# Altium schematic sheet FPGA Symbol1.SchDoc
size A4; Organization: Altium Limited; Address1: L3, 12a Rodborough Rd; Address2: Frenchs Forest; Address3: NSW; Address4: Australia 2086; DocumentNumber: 6; SheetNumber: 6; SheetTotal: 7
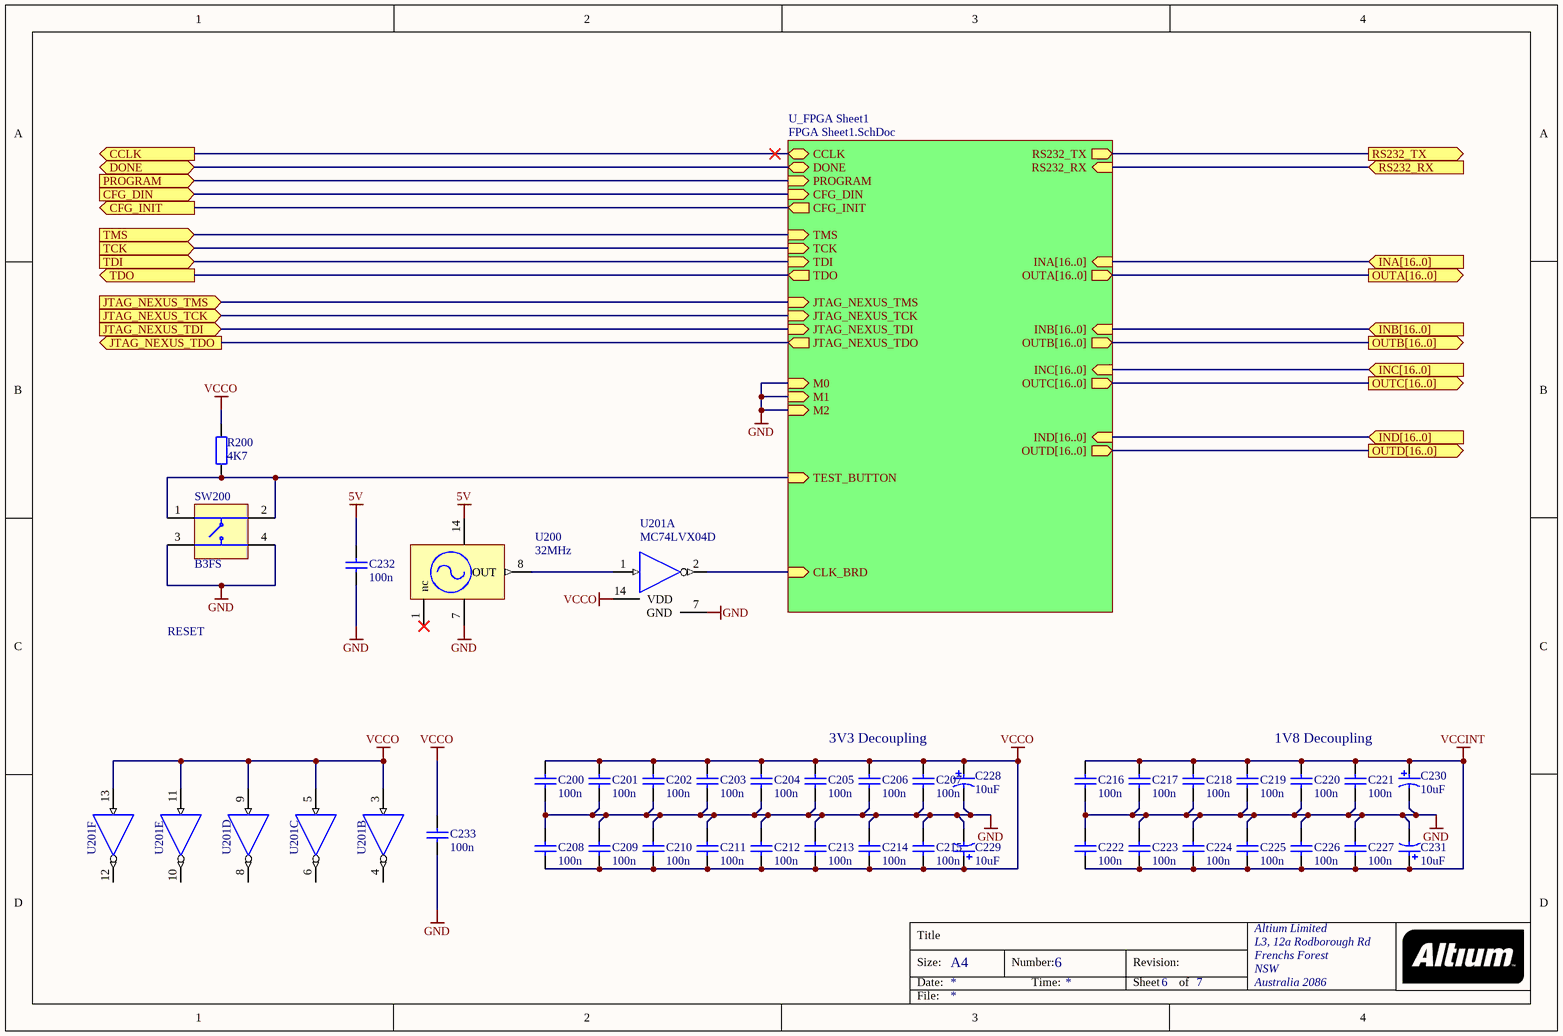
[diagram p0: FPGA Symbol1.SchDoc]

## Parts
C200  100n  [CC2012-0805]
C201  100n  [CC2012-0805]
C202  100n  [CC2012-0805]
C203  100n  [CC2012-0805]
C204  100n  [CC2012-0805]
C205  100n  [CC2012-0805]
C206  100n  [CC2012-0805]
C207  100n  [CC2012-0805]
C208  100n  [CC2012-0805]
C209  100n  [CC2012-0805]
C210  100n  [CC2012-0805]
C211  100n  [CC2012-0805]
C212  100n  [CC2012-0805]
C213  100n  [CC2012-0805]
C214  100n  [CC2012-0805]
C215  100n  [CC2012-0805]
C216  100n  [CC2012-0805]
C217  100n  [CC2012-0805]
C218  100n  [CC2012-0805]
C219  100n  [CC2012-0805]
C220  100n  [CC2012-0805]
C221  100n  [CC2012-0805]
C222  100n  [CC2012-0805]
C223  100n  [CC2012-0805]
C224  100n  [CC2012-0805]
C225  100n  [CC2012-0805]
C226  100n  [CC2012-0805]
C227  100n  [CC2012-0805]
C228  10uF  [MCCT-B]
C229  10uF  [MCCT-B]
C230  10uF  [MCCT-B]
C231  10uF  [MCCT-B]
C232  100n  [CC2012-0805]
C233  100n  [CC2012-0805]
R200  4K7  [CC2012-0805]
SW200  B3FS  [B3FS_SWITCH]
U200  32MHz  [XO600CP]
U201  MC74LVX04D  [751A-03]  (parts A,B,C,D,E,F of 6)

## Sub-sheets
U_FPGA Sheet1 = FPGA Sheet1.SchDoc: CFG_DIN (in), CFG_INIT (out), CLK_BRD (in), INA[16..0] (in), INC[16..0] (in), JTAG_NEXUS_TCK (in), JTAG_NEXUS_TDI (in), JTAG_NEXUS_TDO (out), JTAG_NEXUS_TMS (in), OUTA[16..0] (out), OUTB[16..0] (out), OUTC[16..0] (out), OUTD[16..0] (out), RS232_RX (in), RS232_TX (out), TEST_BUTTON (in), CCLK (bidir), DONE (bidir), M0 (in), M1 (in), M2 (in), PROGRAM (in), TCK (in), TDI (in), TDO (out), TMS (in), INB[16..0] (in), IND[16..0] (in)

## Ports
CCLK (out), CFG_DIN (in), CFG_INIT (out), DONE (bidir), INA[16..0] (in), INB[16..0] (in), INC[16..0] (in), IND[16..0] (in), JTAG_NEXUS_TCK (in), JTAG_NEXUS_TDI (in), JTAG_NEXUS_TDO (out), JTAG_NEXUS_TMS (in), OUTA[16..0] (out), OUTB[16..0] (out), OUTC[16..0] (out), OUTD[16..0] (out), PROGRAM (in), RS232_RX (in), RS232_TX (out), TCK (in), TDI (in), TDO (out), TMS (in)

## Nets
5V: C232.1 U200.14(VCC)
GND: C200.2 C201.2 C202.2 C203.2 C204.2 C205.2 C206.2 C207.2 C208.1 C209.1 C210.1 C211.1 C212.1 C213.1 C214.1 C215.1 C216.2 C217.2 C218.2 C219.2 C220.2 C221.2 C222.1 C223.1 C224.1 C225.1 C226.1 C227.1 C228.2 C229.2 C230.2 C231.2 C232.2 C233.2 SW200.3 SW200.4 U200.7(GND) U201.7(GND) ; sheet U_FPGA Sheet1/M0, sheet U_FPGA Sheet1/M1, sheet U_FPGA Sheet1/M2
VCCINT: C216.1 C217.1 C218.1 C219.1 C220.1 C221.1 C222.2 C223.2 C224.2 C225.2 C226.2 C227.2 C230.1 C231.1
VCCO: C200.1 C201.1 C202.1 C203.1 C204.1 C205.1 C206.1 C207.1 C208.2 C209.2 C210.2 C211.2 C212.2 C213.2 C214.2 C215.2 C228.1 C229.1 C233.1 R200.2 U201.3(IN) U201.5(IN) U201.9(IN) U201.11(IN) U201.13(IN) U201.14(VDD)
CCLK: port CCLK, sheet U_FPGA Sheet1/CCLK
CFG_DIN: port CFG_DIN, sheet U_FPGA Sheet1/CFG_DIN
CFG_INIT: port CFG_INIT, sheet U_FPGA Sheet1/CFG_INIT
DONE: port DONE, sheet U_FPGA Sheet1/DONE
JTAG_NEXUS_TCK: port JTAG_NEXUS_TCK, sheet U_FPGA Sheet1/JTAG_NEXUS_TCK
JTAG_NEXUS_TDI: port JTAG_NEXUS_TDI, sheet U_FPGA Sheet1/JTAG_NEXUS_TDI
JTAG_NEXUS_TDO: port JTAG_NEXUS_TDO, sheet U_FPGA Sheet1/JTAG_NEXUS_TDO
JTAG_NEXUS_TMS: port JTAG_NEXUS_TMS, sheet U_FPGA Sheet1/JTAG_NEXUS_TMS
PROGRAM: port PROGRAM, sheet U_FPGA Sheet1/PROGRAM
RS232_RX: port RS232_RX, sheet U_FPGA Sheet1/RS232_RX
RS232_TX: port RS232_TX, sheet U_FPGA Sheet1/RS232_TX
TCK: port TCK, sheet U_FPGA Sheet1/TCK
TDI: port TDI, sheet U_FPGA Sheet1/TDI
TDO: port TDO, sheet U_FPGA Sheet1/TDO
TMS: port TMS, sheet U_FPGA Sheet1/TMS
NetR200_1: R200.1 SW200.1 SW200.2 ; sheet U_FPGA Sheet1/TEST_BUTTON
NetU200_8: U200.8(OUT) U201.1(IN)
NetU201_2: U201.2(~{OUT}) ; sheet U_FPGA Sheet1/CLK_BRD

Not connected (* = marked no-connect by the designer): U200 1(nc)*; U201 4(~{OUT}) 6(~{OUT}) 8(~{OUT}) 10(~{OUT}) 12(~{OUT})

## Buses and harness runs
bus port INA[16..0] = sheet U_FPGA Sheet1/INA[16..0]
bus port INB[16..0] = sheet U_FPGA Sheet1/INB[16..0]
bus port INC[16..0] = sheet U_FPGA Sheet1/INC[16..0]
bus port IND[16..0] = sheet U_FPGA Sheet1/IND[16..0]
bus port OUTA[16..0] = sheet U_FPGA Sheet1/OUTA[16..0]
bus port OUTB[16..0] = sheet U_FPGA Sheet1/OUTB[16..0]
bus port OUTC[16..0] = sheet U_FPGA Sheet1/OUTC[16..0]
bus port OUTD[16..0] = sheet U_FPGA Sheet1/OUTD[16..0]

## Notes on the sheet
- RESET
- 3V3 Decoupling
- 1V8 Decoupling
- Title
- Size:
- Date:
- A4
- Number:
- Time:
- Revision:
- Sheet
- of
- File:

## Library data of the parts
C200-C227 C232 C233 = CAP: Capacitor; Fitted: True
C228-C231 = CAP_POLAR: Polar Capacitor
  C229-C231: Supplier: FARNELL; Supplier Code: 967-117
R200 = Res2: Resistor; Manufacturer: Generic Components; Class I: Passive; Published: 8-Jun-2000; Revision: July-2002: Re-released for DXP Platform.; Publisher: Altium Limited; Class II: Resistor
SW200 = B3FS: SPNA SMD Keyboard Switch; Fitted: True
U200 = XO_CAN_DIP14_1M: IC, Oscillator, Canned, CMOS o/p, General Purpose, No Enable/Disable, 32MHz; Text Field1: TBA
U201 = MC74LVX04D: Hex Inverter with 5V-Tolerant Inputs; Manufacturer: ON Semiconductor; Code - JEDEC: MS-012-AB; Code - IPC: SO14; Published: 15-Apr-2002; Datasheet: Latest Revision: 1997; Package Reference: 751A-03; Publisher: Altium Limited